# EAGLE schematic FrontPanel (EAGLE 7.7.0)
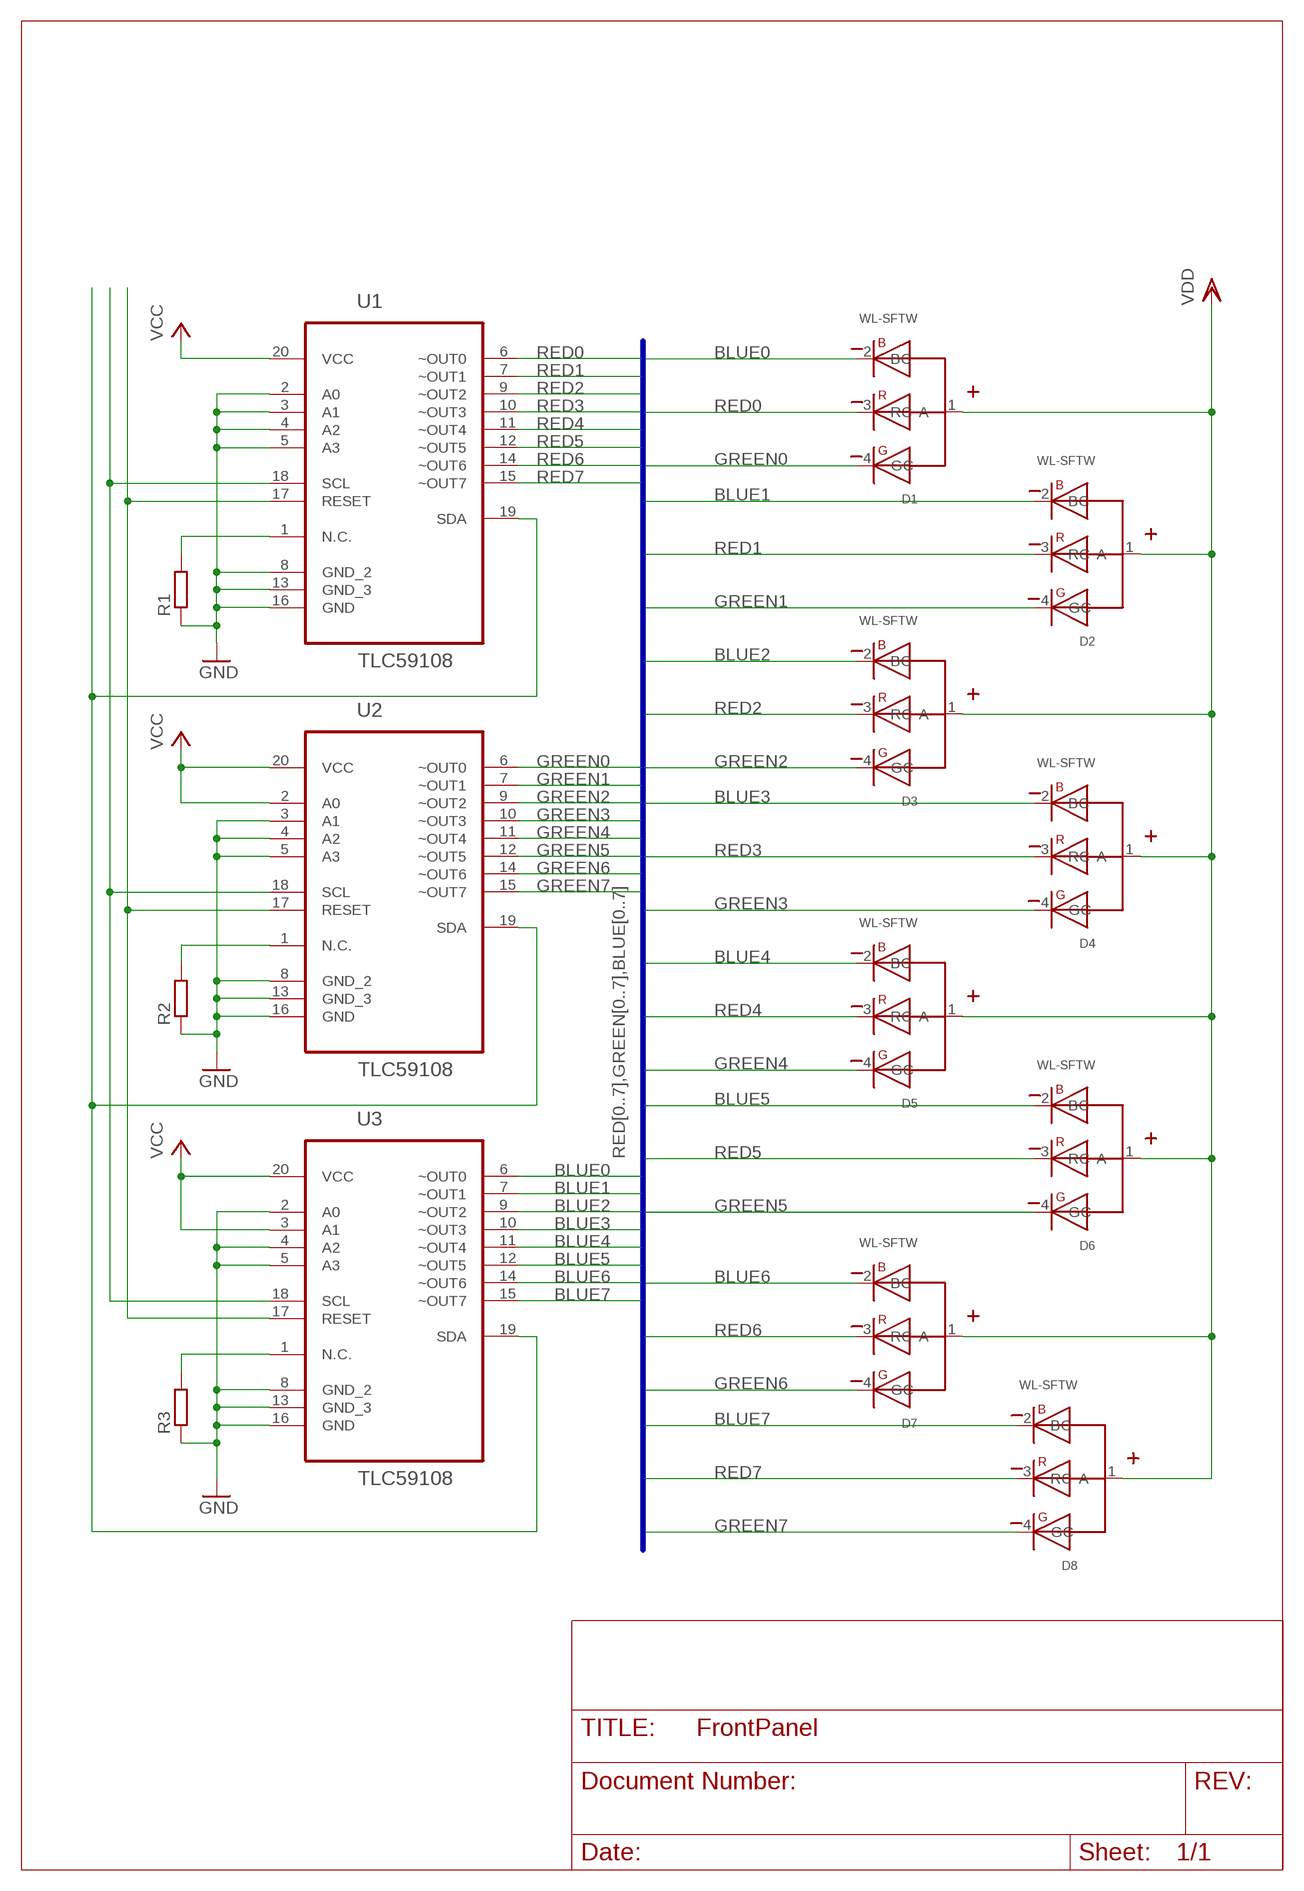
[diagram p0: schematic, sheet 1]

## Parts
D1  WL-SFTW  WL-SFTW-150141M173100-R&G&B  [3528-COMMON-ANODE]
D2  WL-SFTW  WL-SFTW-150141M173100-R&G&B  [3528-COMMON-ANODE]
D3  WL-SFTW  WL-SFTW-150141M173100-R&G&B  [3528-COMMON-ANODE]
D4  WL-SFTW  WL-SFTW-150141M173100-R&G&B  [3528-COMMON-ANODE]
D5  WL-SFTW  WL-SFTW-150141M173100-R&G&B  [3528-COMMON-ANODE]
D6  WL-SFTW  WL-SFTW-150141M173100-R&G&B  [3528-COMMON-ANODE]
D7  WL-SFTW  WL-SFTW-150141M173100-R&G&B  [3528-COMMON-ANODE]
D8  WL-SFTW  WL-SFTW-150141M173100-R&G&B  [3528-COMMON-ANODE]
R1  R-EU_R0402  [R0402]
R2  R-EU_R0402  [R0402]
R3  R-EU_R0402  [R0402]
U1  TLC59108  TLC59108FIPWR  [SOP65P640X120-20N]
U2  TLC59108  TLC59108FIPWR  [SOP65P640X120-20N]
U3  TLC59108  TLC59108FIPWR  [SOP65P640X120-20N]

## Nets
BLUE0: D1.2(BC) U3.6(~OUT0)
BLUE1: D2.2(BC) U3.7(~OUT1)
BLUE2: D3.2(BC) U3.9(~OUT2)
BLUE3: D4.2(BC) U3.10(~OUT3)
BLUE4: D5.2(BC) U3.11(~OUT4)
BLUE5: D6.2(BC) U3.12(~OUT5)
BLUE6: D7.2(BC) U3.14(~OUT6)
BLUE7: D8.2(BC) U3.15(~OUT7)
GND: R1.1 R2.1 R3.1 U1.2(A0) U1.3(A1) U1.4(A2) U1.5(A3) U1.8(GND_2) U1.13(GND_3) U1.16(GND) U2.3(A1) U2.4(A2) U2.5(A3) U2.8(GND_2) U2.13(GND_3) U2.16(GND) U3.2(A0) U3.4(A2) U3.5(A3) U3.8(GND_2) U3.13(GND_3) U3.16(GND)
GREEN0: D1.4(GC) U2.6(~OUT0)
GREEN1: D2.4(GC) U2.7(~OUT1)
GREEN2: D3.4(GC) U2.9(~OUT2)
GREEN3: D4.4(GC) U2.10(~OUT3)
GREEN4: D5.4(GC) U2.11(~OUT4)
GREEN5: D6.4(GC) U2.12(~OUT5)
GREEN6: D7.4(GC) U2.14(~OUT6)
GREEN7: D8.4(GC) U2.15(~OUT7)
N$1: R3.2 U3.1(N.C.)
N$2: R2.2 U2.1(N.C.)
N$3: R1.2 U1.1(N.C.)
RED0: D1.3(RC) U1.6(~OUT0)
RED1: D2.3(RC) U1.7(~OUT1)
RED2: D3.3(RC) U1.9(~OUT2)
RED3: D4.3(RC) U1.10(~OUT3)
RED4: D5.3(RC) U1.11(~OUT4)
RED5: D6.3(RC) U1.12(~OUT5)
RED6: D7.3(RC) U1.14(~OUT6)
RED7: D8.3(RC) U1.15(~OUT7)
RESET: U1.17(RESET) U2.17(RESET) U3.17(RESET)
SCL: U1.18(SCL) U2.18(SCL) U3.18(SCL)
SDA: U1.19(SDA) U2.19(SDA) U3.19(SDA)
VCC: D1.1(A) D2.1(A) D3.1(A) D4.1(A) D5.1(A) D6.1(A) D7.1(A) D8.1(A) U1.20(VCC) U2.2(A0) U2.20(VCC) U3.3(A1) U3.20(VCC) ; supply symbol labelled VDD

## Buses
RED[0..7],GREEN[0..7],BLUE[0..7]

## Library data of the parts
D1-D8 = WURTH-COLOR_LED-rev1:WL-SFTW: SMD full-color TOP LED Characteristics Low energy consumption High reliability Low current requirement Fast switching No UV/IR radiation High brightness RGB individual control Compact package outline Black surface Applications Flash light Switch indicators Equipments indicators Accent and decorative lighting Electronic signage Video displays Backlight for LCDs, PDAs and TVs Oven, microwave Street lighting Ideal for lateral coupling in light guides <http://katalog.we-online.de/media/images/eipal/WL-SFTW_pf2.jpg> Details see: http://katalog.we-online.de/en/led/WL-SFTW?m Updated 2015-04-10 2015 (C) Wurth Elektronik
R1-R3 = resistor:R-EU_: RESISTOR, European symbol
U1-U3 = Texas Instruments_By_element14_Batch_1:TLC59108FIPWR: LED Driver; MPN: TLC59108FIPWR; OC_FARNELL: -; OC_NEWARK: 09R6478; PACKAGE: TSSOP-20; SUPPLIER: Texas Instruments